# Altium schematic sheet Sheet1.SchDoc
size A4
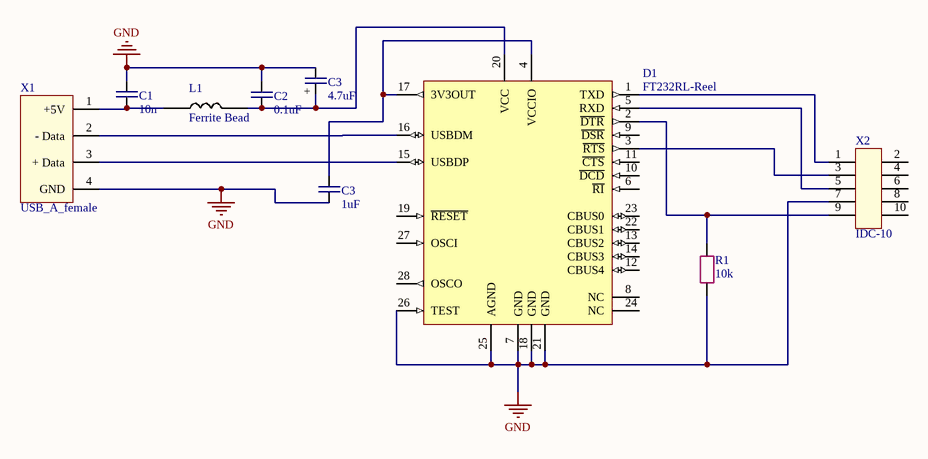
[diagram p0: Sheet1.SchDoc]

## Parts
(Parts that share a designator on the sheet are numbered #1, #2 ... from top to bottom, then left to right.)
C1  10n  [C_0805]
C2  0.1uF  [C_0805]
C3#1  4.7uF  [C_TECAP_A]
C3#2  1uF  [C_0805]
D1  FT232RL-Reel  [SSOP-28_M]
L1  Ferrite Bead  [R_0805]
R1  10k  [R_0805]
X1  USB_A_female  [USB_A_female]
X2  IDC-10  [IDC-10]

## Nets
GND: C1.2 C2.2 C3#1.2 C3#2.1 D1.7(GND) D1.18(GND) D1.21(GND) D1.25(AGND) D1.26(TEST) R1.1 X1.4(GND) X2.7
NetC1_1: C1.1 L1.1 X1.1(+5V)
NetC2_1: C2.1 C3#1.+ D1.20(VCC) L1.2
NetC3#2_2: C3#2.2 D1.4(VCCIO) D1.17(3V3OUT)
NetD1_1: D1.1(TXD) X2.1
NetD1_2: D1.2(~{DTR}) R1.2 X2.9
NetD1_3: D1.3(~{RTS}) X2.3
NetD1_5: D1.5(RXD) X2.5
NetD1_15: D1.15(USBDP) X1.3(+_Data)
NetD1_16: D1.16(USBDM) X1.2(-_Data)

Not connected (* = marked no-connect by the designer): D1 6(~{RI}) 8(NC) 9(~{DSR}) 10(~{DCD}) 11(~{CTS}) 12(CBUS4) 13(CBUS2) 14(CBUS3) 19(~{RESET}) 22(CBUS1) 23(CBUS0) 24(NC) 27(OSCI) 28(OSCO); X2 2 4 6 8 10

## Library data of the parts
C1 C2 C3#2 = capacitor 0805
C3#1 = capacitor_TECAP_SMD_A
D1 = FT232RL-Reel: USB UART Asynchronous Serial Data Transfer Chip, SSOP-28, Tape and Reel; Published: 19-Aug-2010; DatasheetVersion: ver 2.07, Jul-2010; PackageVersion: 2010; PackageReference: SSOP-28; Publisher: Altium Limited; PackageDescription: 28-Pin Small Outline Package 0.65 mm Pitch; ComponentLink1Description: Manufacturer Link; ComponentLink1URL: http://www.ftdichip.com/Products/ICs/FT232R.htm; ComponentLink2Description: Datasheet; ComponentLink2URL: http://www.ftdichip.com/Support/Documents/DataSheets/ICs/DS_FT232R.pdf
L1 = inductance_cm453232
R1 = resistor 0805
X2 = IDC-10: разъем 4130